# Altium schematic sheet schematic.SchDoc
size A4; SheetNumber: 1; SheetTotal: 1; SPICEModelCacheVFORKPWS: <root> / <DocumentId>VFORKPWS</DocumentId> / </root>
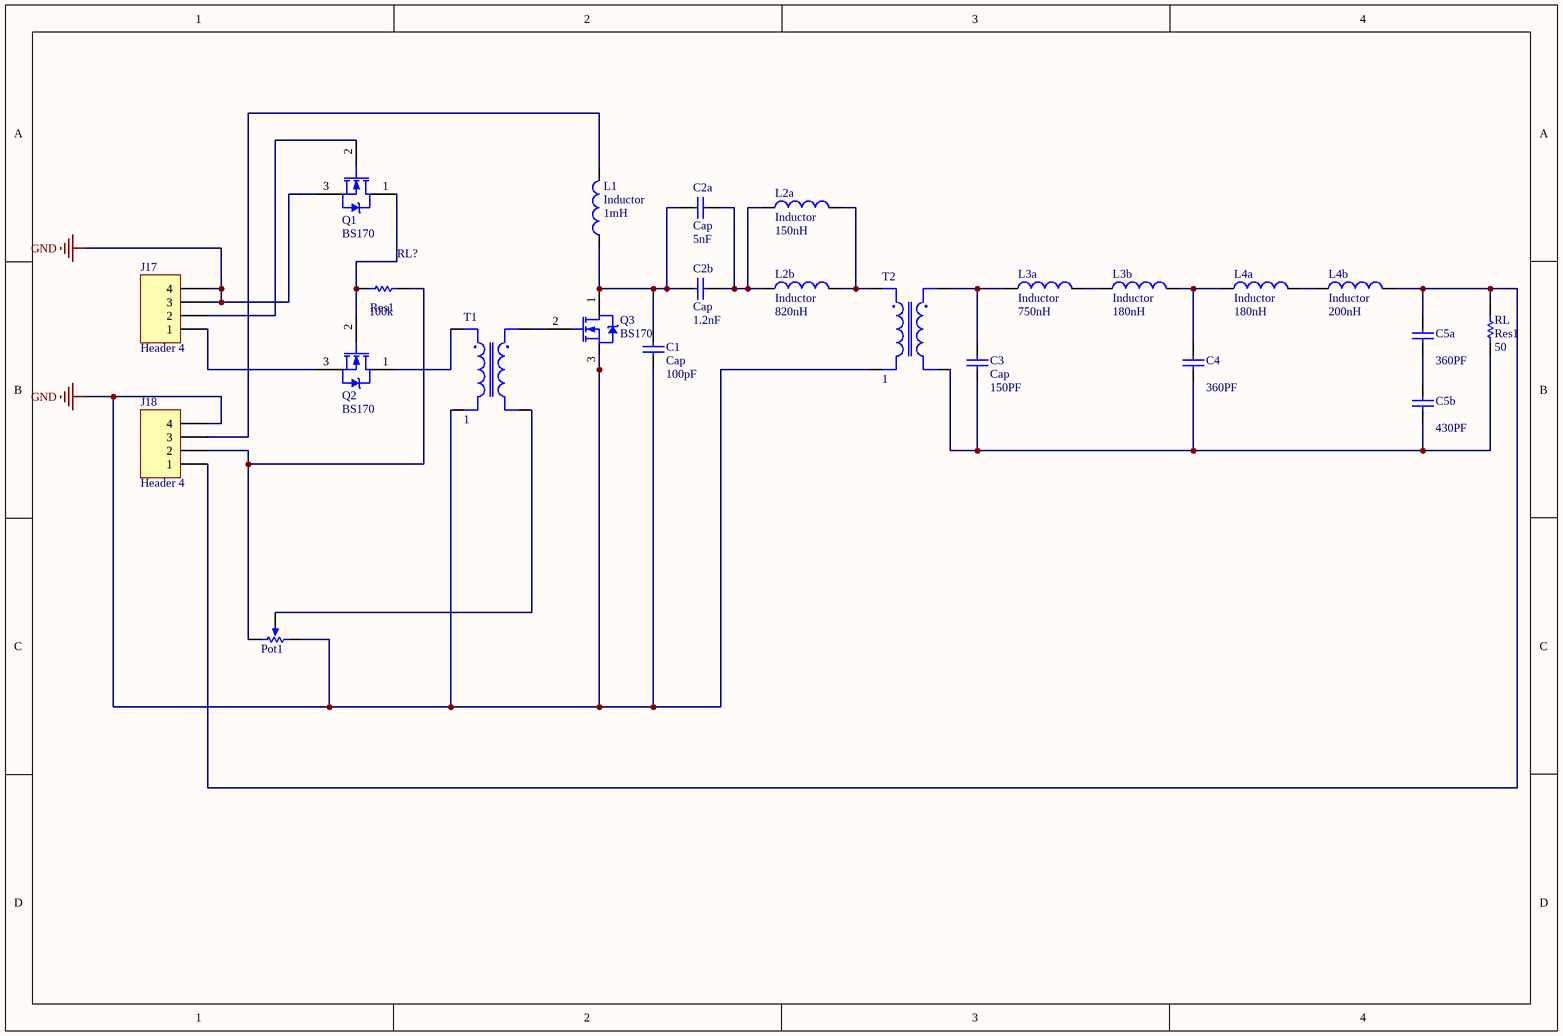
[diagram p0: schematic.SchDoc]

## Parts
C1  Cap  value 100pF  [RAD-0.1]
C2a  Cap  value 5nF  [RAD-0.1]
C2b  Cap  value 1.2nF  [RAD-0.1]
C3  Cap  value 150PF  [RAD-0.1]
C4  value 360PF  [RAD-0.1]  (hidden comment: Cap)
C5a  value 360PF  [RAD-0.1]  (hidden comment: Cap)
C5b  value 430PF  [RAD-0.1]  (hidden comment: Cap)
J17  Header 4  [HDR1X4]
J18  Header 4  [HDR1X4]
L1  Inductor  value 1mH  [INDC4532]
L2a  Inductor  value 150nH  [2029]
L2b  Inductor  value 820nH  [2029]
L3a  Inductor  value 750nH  [2029]
L3b  Inductor  value 180nH  [2029]
L4a  Inductor  value 180nH  [2029]
L4b  Inductor  value 200nH  [2029]
Pot1  Potentiometer  (value not drawn)
Q1  BS170  [ONSC-TO-92-3-29-11]
Q2  BS170  [ONSC-TO-92-3-29-11]
Q3  BS170  [ONSC-TO-92-3-29-11]
RL  Res1  value 50  [AXIAL-0.3]
RL?  Res1  value 100k  [AXIAL-0.1-RES]
T1  GAIN: 1  (hidden comment: Ideal Transformer)
T2  GAIN: 1  (hidden comment: Ideal Transformer)

## Nets
GND: C1.1 J17.3 J17.4 J18.4 Pot1.1(TOP) Q1.3(S) Q3.3(S) T1.2 T2.2
NetC1_2: C1.2 C2a.1 C2b.1 L1.1 Q3.1(D)
NetC2a_2: C2a.2 C2b.2 L2a.1 L2b.1
NetC3_1: C3.1 C4.1 C5b.1 RL.1 T2.4
NetC3_2: C3.2 L3a.1 T2.3
NetC4_2: C4.2 L3b.2 L4a.1
NetC5a_1: C5a.1 C5b.2
NetC5a_2: C5a.2 J18.1 L4b.2 RL.2
NetJ17_1: J17.1 Q2.3(S)
NetJ17_2: J17.2 Q1.2(G)
NetJ18_2: J18.2 Pot1.2(BOT) RL?.2
NetJ18_3: J18.3 L1.2
NetL2a_2: L2a.2 L2b.2 T2.1
NetL3a_2: L3a.2 L3b.1
NetL4a_2: L4a.2 L4b.1
NetPot1_3: Pot1.3(TAP) T1.4
NetQ1_1: Q1.1(D) Q2.2(G) RL?.1
NetQ2_1: Q2.1(D) T1.1
NetQ3_2: Q3.2(G) T1.3

## Library data of the parts
C1 C2a C2b C3 = CAP ALUM 1.5UF 20% 50V RADIAL: Ceramic Capacitor, Multilayer, Ceramic, 200V, 10% +Tol, 10% -Tol, X7R, 15% TC, 0.00015uF, Through Hole Mount; Manufacturer Part Number: EEA-GA1H1R5H; Manufacturer: KEMET; Designator: C?; Voltage Rating: 50V; Multilayer: Yes; Published: 8-Jun-2000; LatestRevisionDate: 17-Jul-2002; LatestRevisionNote: Re-released for DXP Platform.; Publisher: Altium Limited; Supplier: Arrow Electronics; Supplier Part Number: C317C151K2R5TA; RoHS: Yes; Category: Ceramic Capacitors; Stock: 1515; Pricing: 1=0.08040, 500=0.06280 (USD); Mounting Technology: Through Hole; Pins: 2; Dielectric Material: Ceramic; Package Shape: Rectangular; Case/Package: 1510; Terminal Finish: Nickel; Min Operating Temperature: -55°C; Max Operating Temperature: 125°C; JESD-609 Code: e3; Capacitor Type: Ceramic; Tolerance  (fill in as +-): 10%; Package Style: RadialMeter; Packaging: Bulk; Tolerance (fill in as +-): 10%; Rated DC Voltage (URdc): 200V; Temperature Characteristics Code: X7R; Termination: Wire; Length: 3.81mm; Width: 2.54mm; Height: 5.84mm; Terminal Pitch: 5.08mm; Reach SVHC Compliant: Yes; RoHS Compliant: Yes; ComponentLink1URL: https://datasheet.ciiva.com:443/pdfs/VipMasterIC/IC/KEME/KEME-S-A0009782347/KEME-S-A0009782347-1.pdf?src-supplier=IHS+Markit; ComponentLink1Description: https://datasheet.ciiva.com:443/pdfs/VipMasterIC/IC/KEME/KEME-S-A0009782347/KEME-S-A0009782347-1.pdf?src-supplier=IHS+Markit; ComponentLink2URL: https://datasheet.ciiva.com/5388/f3101-goldmax-5388710.pdf?src-supplier=Mouser; ComponentLink2Description: https://datasheet.ciiva.com/5388/f3101-goldmax-5388710.pdf?src-supplier=Mouser; Parameter 1: *
C4 C5a C5b = CAP CER 330PF 50V X7R RADIAL: Capacitor; Manufacturer Part Number: K331K15X7RF53L2; Designator: C?; Voltage Rating: 50V; Published: 8-Jun-2000; LatestRevisionDate: 17-Jul-2002; LatestRevisionNote: Re-released for DXP Platform.; Publisher: Altium Limited
J17 J18 = Header 4: Header, 4-Pin; LatestRevisionDate: 17-Jul-2002; LatestRevisionNote: Re-released for DXP Platform.; Publisher: Altium Limited
L1 L2a L2b L3a L3b L4a L4b = Inductor: Code_IEC: 1005; Published: 8-Jun-2000; LatestRevisionDate: 29-May-2009; LatestRevisionNote: IPC-7351 Footprint Added.; PackageReference: 0402-A; Publisher: Altium Limited; PackageDescription: Chip Inductor; Code_JEITA: 0402
Pot1 = Potentiometer: value: 1k; position: 0.5; SimulationGenericComponent: True
Q1-Q3 = CMP-1058-00929-1: Small Signal MOSFET, 500 mA, 60 V, N-Channel, 3-Pin TO-92, Bulk Box; Manufacturer: On Semiconductor; VGS Max (V): 20; Configuration: Single; PD Max (W): 0.35; VGS(th) Max (V): 3; ID Max (A): 0.5; V(BR)DSS Min (V): 60; Channel Polarity: N Channel; PackageDescription: 3-Pin Transistor Outline, Body 4.825 x 3.685 mm, Pitch 1.27 mm; Package Type: TO-92; ComponentLink1Description: Manufacturer URL; ComponentLink1URL: http://www.onsemi.com/; DatasheetVersion: Rev. 6; ComponentLink3Description: Package Specification; PartNumber: BS170; ComponentLink2URL: http://www.onsemi.com/pub_link/Collateral/BS170-D.PDF; PackageVersion: Rev. AM; Mounting Technology: Through Hole; PackageReference: TO-92-3-29-11_AM_SL; ComponentLink2Description: Datasheet; ComponentLink3URL: http://www.onsemi.cn/pub_link/Collateral/2N6426-D.PDF; Packing: Bulk Box
RL RL? = RES 150 OHM 5% 1/4W AXIAL: Resistor; Manufacturer Part Number: CFR-25JB-52-150R; Designator: R?; Power Rating: 1/4W; Tolerance: 0.05; Published: 8-Jun-2000; LatestRevisionDate: 17-Jul-2002; LatestRevisionNote: Re-released for DXP Platform.; Publisher: Altium Limited
T1 T2 = Transformer Ideal: SimulationGenericComponent: True